# Altium schematic sheet MAZ000156 - Diagrama físico.SchDoc: MAZ000156 - Diagrama físico
size A; ApprovedBy: Christian Ledwidth; CheckedBy: Nahuel Martinez; Author: Santiago Marti; CompanyName: Body Health; DrawnBy: Santiago Marti; Revision: A; SheetNumber: 2; SheetTotal: 2
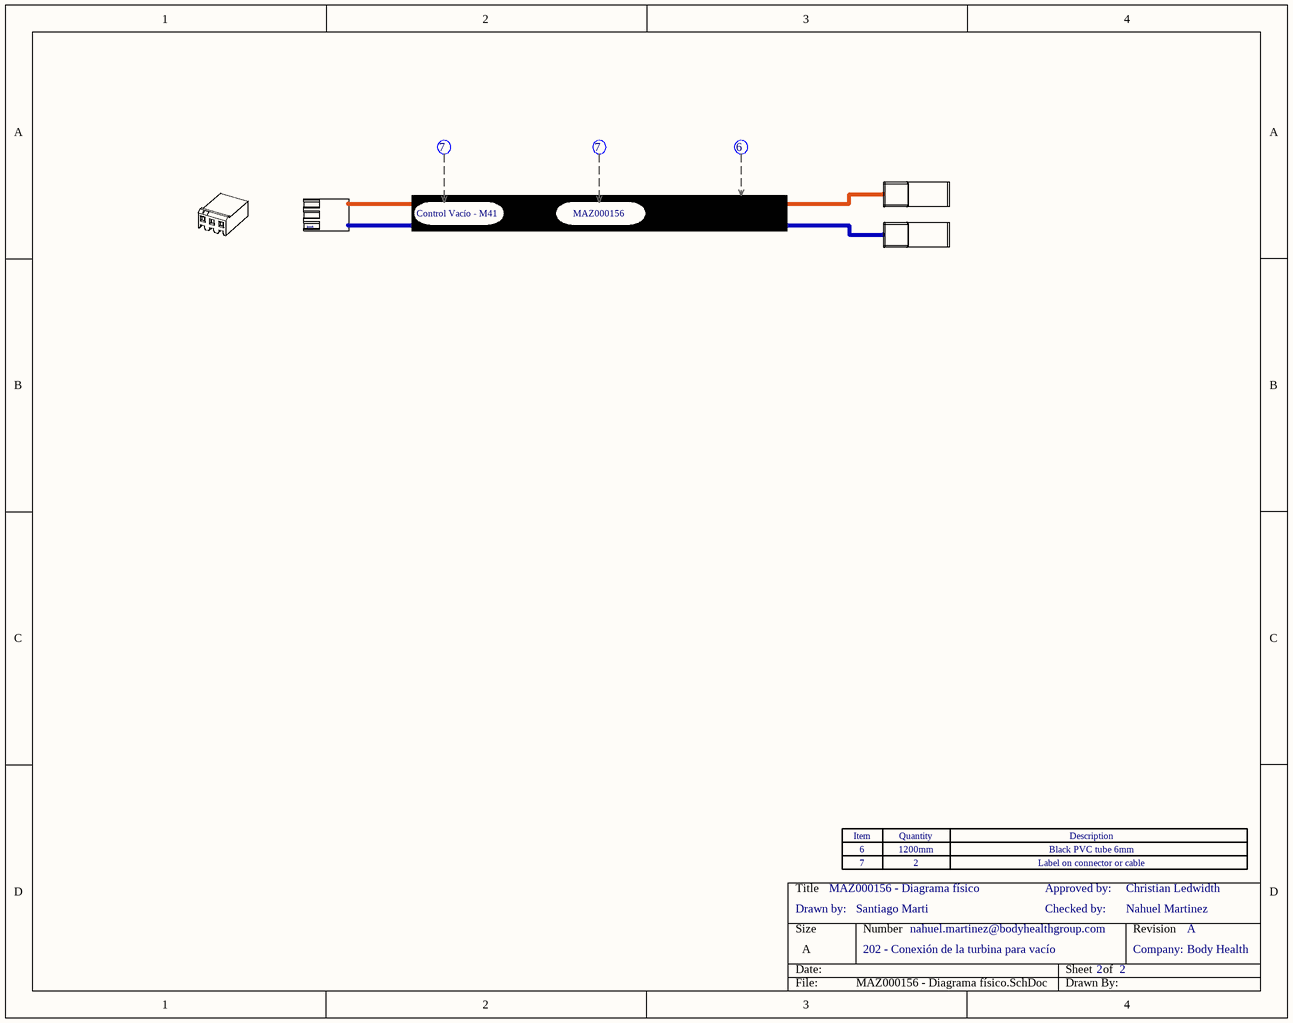
[diagram p0: MAZ000156 - Diagrama físico.SchDoc]

## Parts
(Parts that share a designator on the sheet are numbered #1, #2 ... from top to bottom, then left to right.)
Cab1  Cable  (value not drawn)
Cab2  Cable  (value not drawn)
Cab3  Cable  (value not drawn)
Con1  SL156-3  (value not drawn)  (parts A,B of 4)
Con?#1  Shovel  (value not drawn)  (part A of 4)
Con?#2  Shovel  (value not drawn)  (part A of 4)
Zoc1  Zócalo_Header  (value not drawn)
Zoc8  Zócalo_Item  (value not drawn)
Zoc9  Zócalo_Item  (value not drawn)

## Notes on the sheet
- Control Vacío - M41
- MAZ000156
- Drawn by:
- 6
- 7
- 1200mm
- 2
- Checked by:
- Approved by:
- Black PVC tube 6mm
- Label on connector or cable
- 202 - Conexión de la turbina para vacío
- nahuel.martinez@bodyhealthgroup.com
- Company:
- (in symbol Zócalo_Header) Item; Quantity; Description

## Library data of the parts
Cab1 Cab2 = Cable: CallOut: 7; Largo: *mm; Sección: *mm2; Color: *
Cab3 = Cable: CallOut: 6; Largo: *mm; Sección: *mm2; Color: *
Con1 = SL156-3: CONN RECEPT 3 POS W/RAMP SL-156; Cod.Fabricante: 640250-3; Fabricante: TE Connectivity AMP Connectors; Cod.DigiKey: A19951-ND; ComponentLink1Description: Manufacturer Link; ComponentLink1URL: https://www.te.com/commerce/DocumentDelivery/DDEController?Action=srchrtrv&DocNm=640250&DocType=Customer+Drawing&DocLang=English; DIGIKEYx50: 0.14460; CallOut: *; DIGIKEYx100: 0.13430
Con?#1 Con?#2 = Shovel: CONN HOUSING SHOVEL M4; Cod.DigiKey: -; Cod.Fabricante: -; ComponentLink1Description: Manufacturer Link; ComponentLink1URL: -; DIGIKEYx50: -; Fabricante: -; CallOut: *; DIGIKEYx100: -
Zoc1 = Zócalo_Header: Header para el zócalo de referencias
Zoc8 Zoc9 = Zócalo_Item: Ítem para el zócalo de referencias; Desginator: *; Quantity: *; ItemDescription: *